# Altium schematic sheet Power_Supply_1.SchDoc
size A4; CompanyName: Technische Hochschule Nürnberg Georg Simon Ohm; Organization: UltraZohm; Address1: Kesslerplatz 12; Address2: 90489 Nürnberg; Address3: GERMANY; SheetNumber: 27; Website: www.ultrazohm.com
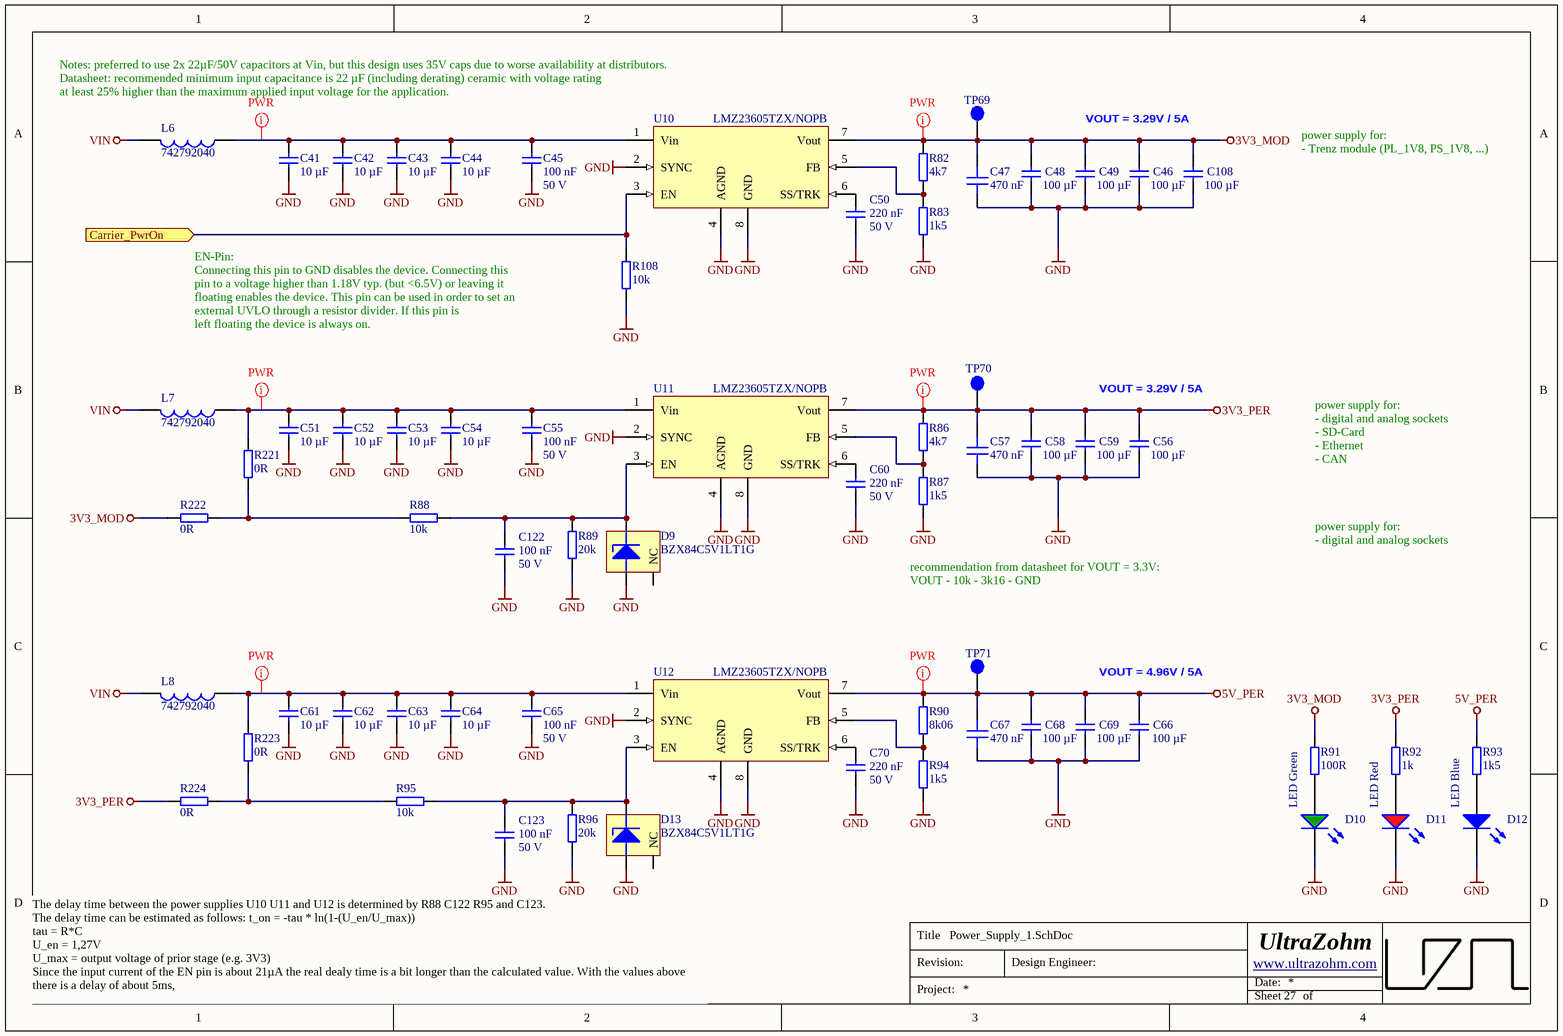
[diagram p0: Power_Supply_1.SchDoc]

## Parts
C41  10 µF  [C_1206_TE]
C42  10 µF  [C_1206_TE]
C43  10 µF  [C_1206_TE]
C44  10 µF  [C_1206_TE]
C45  100 nF  Voltage: 50 V  [C_0603_TE]
C46  100 µF  [C_1206_TE]
C47  470 nF  [C_0603_TE]
C48  100 µF  [C_1206_TE]
C49  100 µF  [C_1206_TE]
C50  220 nF  Voltage: 50 V  [C_0603_TE]
C51  10 µF  [C_1206_TE]
C52  10 µF  [C_1206_TE]
C53  10 µF  [C_1206_TE]
C54  10 µF  [C_1206_TE]
C55  100 nF  Voltage: 50 V  [C_0603_TE]
C56  100 µF  [C_1206_TE]
C57  470 nF  [C_0603_TE]
C58  100 µF  [C_1206_TE]
C59  100 µF  [C_1206_TE]
C60  220 nF  Voltage: 50 V  [C_0603_TE]
C61  10 µF  [C_1206_TE]
C62  10 µF  [C_1206_TE]
C63  10 µF  [C_1206_TE]
C64  10 µF  [C_1206_TE]
C65  100 nF  Voltage: 50 V  [C_0603_TE]
C66  100 µF  [C_1206_TE]
C67  470 nF  [C_0603_TE]
C68  100 µF  [C_1206_TE]
C69  100 µF  [C_1206_TE]
C70  220 nF  Voltage: 50 V  [C_0603_TE]
C108  100 µF  [C_1206_TE]
C122  100 nF  Voltage: 50 V  [C_0603_TE]
C123  100 nF  Voltage: 50 V  [C_0603_TE]
D9  BZX84C5V1LT1G  [SOT95P237X112-3N]
D10  LED Green  [WL-SMCW_0603]
D11  LED Red  [WL-SMCW_0603]
D12  LED Blue  [WL-SMCW_0603]
D13  BZX84C5V1LT1G  [SOT95P237X112-3N]
L6  742792040  [WE-CBF_0805_High Current]
L7  742792040  [WE-CBF_0805_High Current]
L8  742792040  [WE-CBF_0805_High Current]
R82  4k7  [R_0603_TE]
R83  1k5  [R_0603_TE]
R86  4k7  [R_0603_TE]
R87  1k5  [R_0603_TE]
R88  10k  [R_0603_TE]
R89  20k  [R_0603_TE]
R90  8k06  [R_0402_TE]
R91  100R  [R_0603_TE]
R92  1k  [R_0603_TE]
R93  1k5  [R_0603_TE]
R94  1k5  [R_0603_TE]
R95  10k  [R_0603_TE]
R96  20k  [R_0603_TE]
R108  10k  [R_0603_TE]
R221  0R  [R_1206_TE]
R222  0R  [R_1206_TE]
R223  0R  [R_1206_TE]
R224  0R  [R_1206_TE]
TP69  Testpoint 1mm  [TP_1mm]  (value not drawn)  (no BOM)
TP70  Testpoint 1mm  [TP_1mm]  (value not drawn)  (no BOM)
TP71  Testpoint 1mm  [TP_1mm]  (value not drawn)  (no BOM)
U10  LMZ23605TZX/NOPB  [7TO-PMOD]
U11  LMZ23605TZX/NOPB  [7TO-PMOD]
U12  LMZ23605TZX/NOPB  [7TO-PMOD]

## Ports
Carrier_PwrOn (in)

## Nets
3V3_MOD: C46.1 C47.1 C48.1 C49.1 C108.1 R82.2 R91.2 R222.2 TP69.1 U10.7(Vout)
3V3_PER: C56.1 C57.1 C58.1 C59.1 R86.2 R92.2 R224.2 TP70.1 U11.7(Vout)
5V_PER: C66.1 C67.1 C68.1 C69.1 R90.1 R93.2 TP71.1 U12.7(Vout)
GND: C41.2 C42.2 C43.2 C44.2 C45.1 C46.2 C47.2 C48.2 C49.2 C50.2 C51.2 C52.2 C53.2 C54.2 C55.1 C56.2 C57.2 C58.2 C59.2 C60.2 C61.2 C62.2 C63.2 C64.2 C65.1 C66.2 C67.2 C68.2 C69.2 C70.2 C108.2 C122.2 C123.2 D9.1(ANODE) D10.1(K) D11.1(K) D12.1(K) D13.1(ANODE) R83.1 R87.1 R89.1 R94.2 R96.1 R108.1 U10.2(SYNC) U10.4(AGND) U10.8(GND) U11.2(SYNC) U11.4(AGND) U11.8(GND) U12.2(SYNC) U12.4(AGND) U12.8(GND)
VIN: L6.2 L7.2 L8.2
Carrier_PwrOn: R108.2 U10.3(EN) ; port Carrier_PwrOn
NetC41_1: C41.1 C42.1 C43.1 C44.1 C45.2 L6.1 U10.1(Vin)
NetC50_1: C50.1 U10.6(SS/TRK)
NetC51_1: C51.1 C52.1 C53.1 C54.1 C55.2 L7.1 R221.2 U11.1(Vin)
NetC60_1: C60.1 U11.6(SS/TRK)
NetC61_1: C61.1 C62.1 C63.1 C64.1 C65.2 L8.1 R223.2 U12.1(Vin)
NetC70_1: C70.1 U12.6(SS/TRK)
NetC122_1: C122.1 D9.3(KATHODE) R88.2 R89.2 U11.3(EN)
NetC123_1: C123.1 D13.3(KATHODE) R95.2 R96.2 U12.3(EN)
NetD10_2: D10.2(A) R91.1
NetD11_2: D11.2(A) R92.1
NetD12_2: D12.2(A) R93.1
NetR82_1: R82.1 R83.2 U10.5(FB)
NetR86_1: R86.1 R87.2 U11.5(FB)
NetR88_1: R88.1 R221.1 R222.1
NetR90_2: R90.2 R94.1 U12.5(FB)
NetR95_1: R95.1 R223.1 R224.1

Not connected (* = marked no-connect by the designer): D9 2(NC); D13 2(NC)

## Layout directives
net class PWR: 3V3_MOD, 3V3_PER, 5V_PER, NetC41_1, NetC51_1, NetC61_1

## Notes on the sheet
- Notes: preferred to use 2x 22µF/50V capacitors at Vin, but this design uses 35V caps due to worse availability at distributors.
- Datasheet: recommended minimum input capacitance is 22 µF (including derating) ceramic with voltage rating
- at least 25% higher than the maximum applied input voltage for the application.
- VOUT = 3.29V / 5A
- power supply for:
  - Trenz module (PL_1V8, PS_1V8, ...)
- EN-Pin:
  Connecting this pin to GND disables the device. Connecting this pin to a voltage higher than 1.18V typ. (but <6.5V) or leaving it floating enables the device. This pin can be used in order to set an external UVLO through a resistor divider. If this pin is
  left floating the device is always on.
- power supply for:
  - digital and analog sockets
  - SD-Card
  - Ethernet
  - CAN
- power supply for:
  - digital and analog sockets
- recommendation from datasheet for VOUT = 3.3V:
  VOUT - 10k - 3k16 - GND
- VOUT = 4.96V / 5A
- The delay time between the power supplies U10 U11 and U12 is determined by R88 C122 R95 and C123.
  The delay time can be estimated as follows: t_on = -tau * ln(1-(U_en/U_max))
  tau = R*C
  U_en = 1,27V
  U_max = output voltage of prior stage (e.g. 3V3)
  Since the input current of the EN pin is about 21µA the real dealy time is a bit longer than the calculated value. With the values above there is a delay of about 5ms,
- Title
- Revision:
- Design Engineer:
- Date:
- Project:
- Sheet
- of

## Library data of the parts
C41-C44 C51-C54 C61-C64 = UZgen_C_1206_10uF_50V_X7R: Generic capacitor; Manufacturer: UZgen; Tolerance: 10 %; Created from: MGeier; Voltage: 50V; Value: 10 µF; Manufacturer Part Number: UZgen_C_1206_10uF_50V_X7R; PartID: 5807; Created On: 20/03/2025 14:05:00; Device Package: 1206; Last Updated: 20/03/2025 14:05:00; Mounting Type: SMD; Technology: X7R
C45 C55 C65 C122 C123 = UZgen_C_0603_100nF_50V_X7R: Generic capacitor; Manufacturer: UZgen; Tolerance: 10 %; Created from: AGeiger; Value: 100 nF; Technology: X7R; Manufacturer Part Number: UZgen_C_0603_100nF_50V_X7R; PartID: 1; Created On: 02/07/2024 14:42:23; Device Package: 0603; Mounting Type: SMD; Last Updated: 02/08/2024 14:45:57
C46 C48 C49 C56 C58 C59 C66 C68 C69 C108 = CL31A107MQHNNNE: 6.3V 100uF X5R ±20% 1206 Multilayer Ceramic Capacitors MLCC; Manufacturer: Samsung Electro-Mechanics; Created from: MGeier; Tolerance: 20%; Value: 100 µF; Manufacturer Part Number: CL31A107MQHNNNE; PartID: 152; Created On: 02/08/2024 16:00:00; ComponentLink1Description: Datasheet; ComponentLink1URL: https://wmsc.lcsc.com/wmsc/upload/file/pdf/v2/lcsc/2304140030_Samsung-Electro-Mechanics-CL31A107MQHNNNE_C15008.pdf; Component Type: Capacitor 1206; Device Package: 1206; Last Updated: 02/08/2024 16:00:00; Mounting Type: SMD; Operating Temperature: -55 - 85°C; Series: CL; Supplier 1: LCSC; Supplier Part Number 1: C15008; Type: Capacitor; Voltage Rating: 6.3 V; Live Cycle Status: 1; LCSC Part Number: C15008; Stock number: not stored
C47 C57 C67 = CL10A474KB8NNNC: Capacitor 0603, 50 VDC, 470 nF, X5R; Manufacturer: Samsung Electro-Mechanics; Tolerance: 10 %; Created from: AGeiger; Voltage Rating: 50 VDC; Value: 470 nF; Manufacturer Part Number: CL10A474KB8NNNC; PartID: 103; Created On: 22/08/2022 14:44:45; Device Package: 0603; Mounting Type: SMD; Last Updated: 22/04/2025 15:48:45; ComponentLink1Description: Datasheet; ComponentLink1URL: https://datasheet.lcsc.com/lcsc/1810191213_Samsung-Electro-Mechanics-CL10A474KB8NNNC_C170149.pdf; Component Type: Capacitor 0603; Operating Temperature: -55 - 85°C; Series: X5R; Supplier 1: LCSC; Supplier Part Number 1: C170149; Supplier 2: Mouser; Supplier Part Number 2: 187-CL10A474KB8NNNC; Type: Capacitor; Live Cycle Status: 1; LCSC Part Number: C170149
C50 C60 C70 = UZgen_C_0603_220nF_50V_X7R: Generic capacitor; Manufacturer: UZgen; Tolerance: 10 %; Created from: UZgenTool; Value: 220 nF; Technology: X7R; Manufacturer Part Number: UZgen_C_0603_220nF_50V_X7R; PartID: 2; Created On: 02/07/2024 14:42:23; Device Package: 0603; Mounting Type: SMD; Last Updated: 02/08/2024 14:45:57
D9 D13 = 30827: Zener Diode 5.1V 6% 225mW; AN: 30827; Mixed: SMT; Temperature-Range: -65/+150 (Tj Abs); Case: SOT23-3; Voltage: 5.1V; HelpURL: b:\AD\adlib\datasheet\ON_Semiconductor\BZX84CxxxLT1G\; H-ART: BZX84C5V1LT1G; Storage-Temperature: -65/+150 (Tj Abs)
D10 = UZgen_LED_0603_Green: Standard LEDs - SMD 0603 green; Manufacturer: UZgen; Created from: UZgenTool; Manufacturer Part Number: UZgen_LED_0603_Green; PartID: 21; Created On: 09/09/2024 10:45:01; ComponentLink1Description: N/A; ComponentLink1URL: N/A; Component Type: LED Diode; Device Package: 0603; Last Updated: 09/09/2024 10:45:01; Mounting Type: SMD; Supplier 1: LCSC; Supplier Part Number 1: =LCSC Part Number; Type: Standard; Live Cycle Status: 1; Stock number: not stored; Color: green; Value: LED Green
D11 = UZgen_LED_0603_Red: Standard LEDs - SMD 0603 red; Manufacturer: UZgen; Created from: UZgenTool; Manufacturer Part Number: UZgen_LED_0603_Red; PartID: 22; Created On: 09/09/2024 10:45:01; ComponentLink1Description: N/A; ComponentLink1URL: N/A; Component Type: LED Diode; Device Package: 0603; Last Updated: 09/09/2024 10:45:01; Mounting Type: SMD; Supplier 1: LCSC; Supplier Part Number 1: =LCSC Part Number; Type: Standard; Live Cycle Status: 1; Stock number: not stored; Color: red; Value: LED Red
D12 = UZgen_LED_0603_Blue: Standard LEDs - SMD 0603 blue; Manufacturer: UZgen; Created from: UZgenTool; Manufacturer Part Number: UZgen_LED_0603_Blue; PartID: 20; Created On: 09/09/2024 10:45:01; ComponentLink1Description: N/A; ComponentLink1URL: N/A; Component Type: LED Diode; Device Package: 0603; Last Updated: 09/09/2024 10:45:01; Mounting Type: SMD; Supplier 1: LCSC; Supplier Part Number 1: =LCSC Part Number; Type: Standard; Live Cycle Status: 1; Stock number: not stored; Color: blue; Value: LED Blue
L6-L8 = 742792040: Inductance, 0805, 100 MHz, 600 Ohm, 2 A; Manufacturer: Wuerth Elektronik; Type: Inductance SMD; DC current: 2 A; Value: 600 Ohm; Created from: AGeiger; Manufacturer Part Number: 742792040; PartID: 1; Created On: 18/01/2021 14:53:17; ComponentLink1Description: Datasheet; ComponentLink1URL: https://www.mouser.de/datasheet/2/445/742792040-1720361.pdf; Component Type: Inductance; Device Package: 0805; Last Updated: 22/08/2024 07:43:45; Mounting Type: SMD; Operating Temperature: -55 - 125 °C; Series: WE-CBF; Supplier 1: Mouser; Supplier Part Number 1: 710-742792040; Live Cycle Status: 1; LCSC Part Number: C2661857; Stock number: not stored
R82 R86 = UZgen_R_0603_4k7: Generic resistor; Manufacturer: UZgen; Tolerance: 1 %; Created from: UZgenTool; Value: 4k7; Manufacturer Part Number: UZgen_R_0603_4k7; PartID: 237; Created On: 02.07.2024 17:29:50; Device Package: 0603; Mounting Type: SMD; Last Updated: 02.07.2024 17:29:50
R83 R87 R93 R94 = UZgen_R_0603_1k5: Generic resistor; Manufacturer: UZgen; Tolerance: 1 %; Created from: UZgenTool; Value: 1k5; Manufacturer Part Number: UZgen_R_0603_1k5; PartID: 225; Created On: 02.07.2024 17:29:49; Device Package: 0603; Mounting Type: SMD; Last Updated: 02.07.2024 17:29:49
R88 R95 R108 = UZgen_R_0603_10k: Generic resistor; Manufacturer: UZgen; Tolerance: 1 %; Created from: AGeiger; Value: 10k; Manufacturer Part Number: UZgen_R_0603_10k; PartID: 1; Created On: 02/07/2024 14:34:53; Device Package: 0603; Mounting Type: SMD; Last Updated: 02/07/2024 14:37:16
R89 R96 = UZgen_R_0603_20k: Generic resistor; Manufacturer: UZgen; Tolerance: 1 %; Created from: UZgenTool; Value: 20k; Manufacturer Part Number: UZgen_R_0603_20k; PartID: 251; Created On: 02.07.2024 17:29:50; Device Package: 0603; Mounting Type: SMD; Last Updated: 02.07.2024 17:29:50
R90 = UZgen_R_0402_8k06: Non generic resistor; Manufacturer: UZgen; Tolerance: 1 %; Created from: UZgenTool; Value: 8k06; Manufacturer Part Number: UZgen_R_0402_8k06; PartID: 584; Created On: 08.07.2024 14:34:30; Device Package: 0402; Mounting Type: SMD; Last Updated: 08.07.2024 14:34:30
R91 = UZgen_R_0603_100R: Generic resistor; Manufacturer: UZgen; Tolerance: 1 %; Created from: UZgenTool; Value: 100R; Manufacturer Part Number: UZgen_R_0603_100R; PartID: 197; Created On: 02.07.2024 17:29:48; Device Package: 0603; Mounting Type: SMD; Last Updated: 02.07.2024 17:29:48
R92 = UZgen_R_0603_1k: Generic resistor; Manufacturer: UZgen; Tolerance: 1 %; Created from: UZgenTool; Value: 1k; Manufacturer Part Number: UZgen_R_0603_1k; PartID: 221; Created On: 02.07.2024 17:29:49; Device Package: 0603; Mounting Type: SMD; Last Updated: 02.07.2024 17:29:49
R221-R224 = UZgen_R_1206_0R: Generic resistor; Manufacturer: UZgen; Tolerance: 1 %; Created from: UZgenTool; Value: 0R; Manufacturer Part Number: UZgen_R_1206_0R; PartID: 583; Created On: 08/07/2024 14:34:30; Device Package: 1206; Mounting Type: SMD; Last Updated: 08/07/2024 14:34:30
TP69-TP71 = 25063: AN: 25063; Mixed: SMT
U10-U12 = LMZ23605TZX/NOPB: Switching Voltage Regulators Gen2 36Vin 5A Module; Manufacturer: Texas Instruments; Created from: FRosner; Manufacturer Part Number: LMZ23605TZX/NOPB; PartID: 8; Created On: 28/06/2024 11:02:49; ComponentLink1Description: Datasheet; ComponentLink1URL: https://www.ti.com/lit/ds/symlink/lmz23605.pdf; Component Type: DC-DC Converters ROHS; Device Package: TO-PMOD-7; Last Updated: 06/08/2024 16:10:42; Mounting Type: SMD; Operating Temperature: -40 - 85 °C; Supplier 1: LCSC; Supplier Part Number 1: C913851; Type: Switching Voltage Regulators; Live Cycle Status: 1; LCSC Part Number: C913851; Stock number: not stored